# Altium project V1.0.PrjPcb
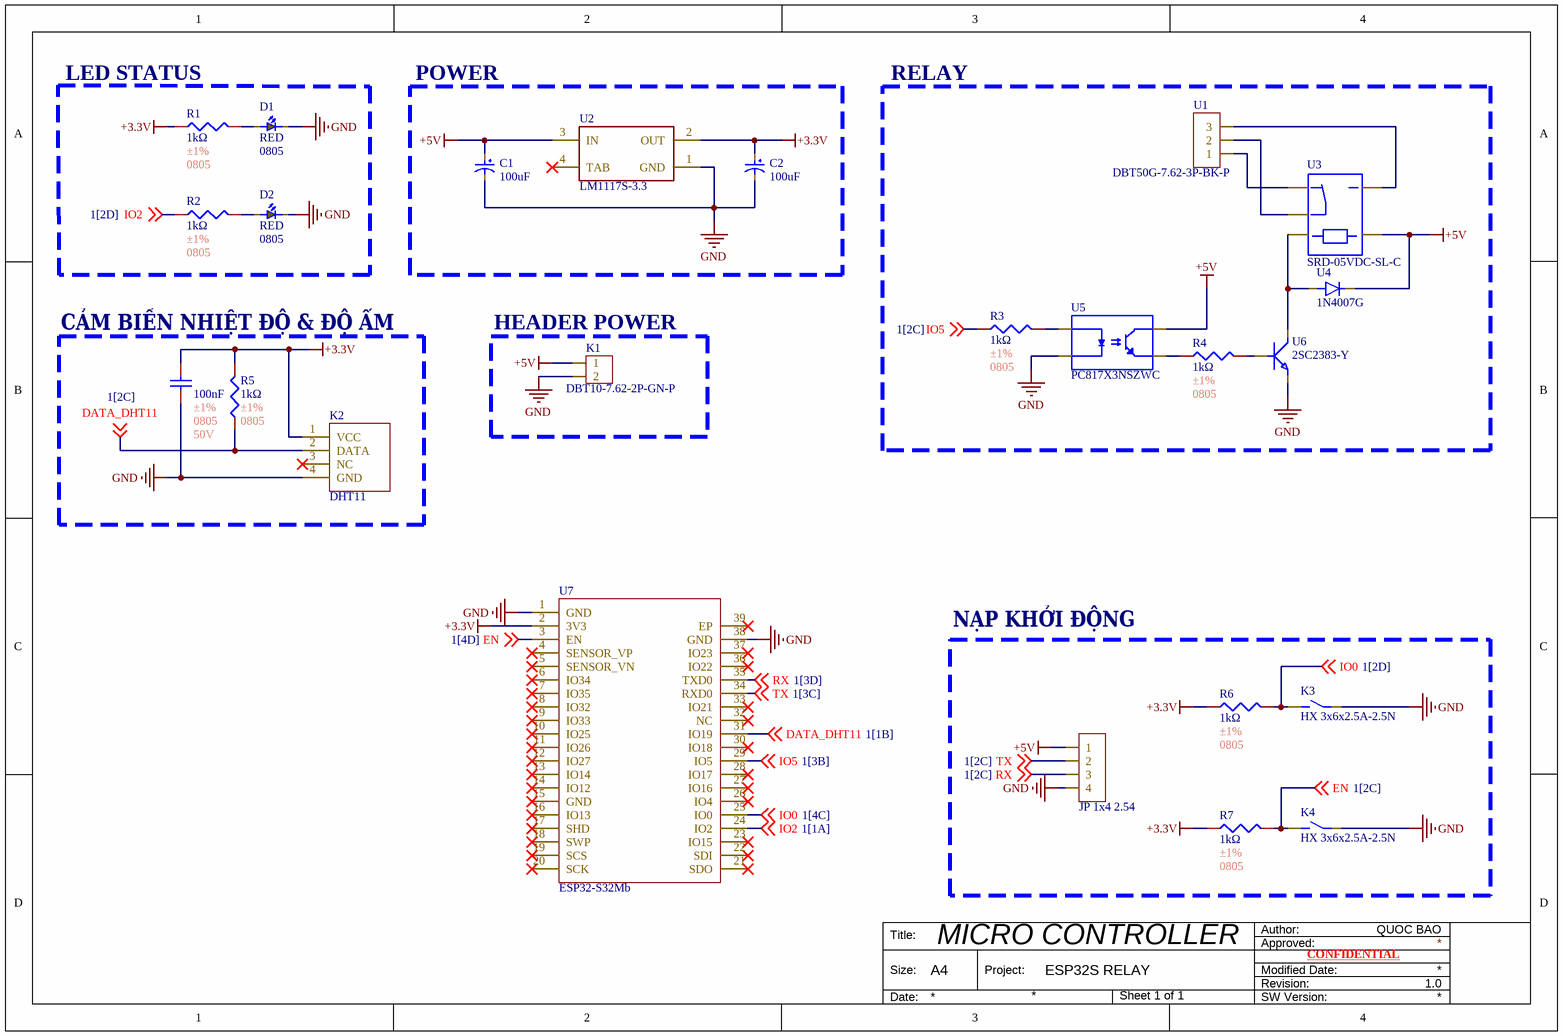
[diagram p0: Micro Controller.SchDoc]
1 sheet, 24 parts. Net scope: global (net labels, ports and power ports of the same name join across sheets).
Board file: PCB1.PcbDoc

## Sheet Micro Controller.SchDoc: MICRO CONTROLLER
size A4; Author: QUOC BAO; Revision: 1.0; SheetNumber: 1; SheetTotal: 1; ProjectTitle: ESP32S RELAY

### Parts
C1  100uF  [C_TH_8x11.5]
C2  100uF  [C_TH_8x11.5]
C3  100nF  Tolerance: ±1%  Package: 0805  Voltage Rating: 50V  [C0805]
D1  RED  Package: 0805  [LED0805]
D2  RED  Package: 0805  [LED0805]
JP1  JP 1x4 2.54  [JP 1X4 DT]
K1  DBT10-7.62-2P-GN-P  [DBT10-7.62-2P-GN-P]
K2  DHT11  [DHT11]
K3  HX 3x6x2.5A-2.5N  [HX 3x6x2.5A-2.5N]
K4  HX 3x6x2.5A-2.5N  [HX 3x6x2.5A-2.5N]
R1  1kΩ  Tolerance: ±1%  Package: 0805  [R0805]
R2  1kΩ  Tolerance: ±1%  Package: 0805  [R0805]
R3  1kΩ  Tolerance: ±1%  Package: 0805  [R0805]
R4  1kΩ  Tolerance: ±1%  Package: 0805  [R0805]
R5  1kΩ  Tolerance: ±1%  Package: 0805  [R0805]
R6  1kΩ  Tolerance: ±1%  Package: 0805  [R0805]
R7  1kΩ  Tolerance: ±1%  Package: 0805  [R0805]
U1  DBT50G-7.62-3P-BK-P  [DBT50G-7.62-3P-BK-P]
U2  LM1117S-3.3  [AMS1117-3.3]
U3  SRD-05VDC-SL-C  [SRD-05VDC-SL-C]
U4  1N4007G  [1N4007G]
U5  PC817X3NSZWC  [PC817X3NSZWC]
U6  2SC2383-Y  [2SC2383-Y]
U7  ESP32-S32Mb  [ESP32-S32Mb]

### Blocks framed on the sheet
LED STATUS: D1 D2 R1 R2
POWER: C1 C2 U2
RELAY: R3 R4 U1 U3-U6
CẢM BIẾN NHIỆT ĐỘ & ĐỘ ẨM: C3 K2 R5
HEADER POWER: K1

### Nets
+3.3V: C2.1 C3.1 K2.1(VCC) R1.1 R5.2 R6.1 R7.1 U2.2(OUT) U7.2(3V3)
+5V: C1.1 JP1.1 K1.1 U2.3(IN) U3.1 U4.1(C) U5.4(COLLECTOR)
GND: C1.2 C2.2 C3.2 D1.2 D2.2 JP1.4 K1.2 K2.4(GND) K3.2 K4.2 U2.1(GND) U5.2(CATHODE) U6.3 U7.1(GND) U7.38(GND)
DATA_DHT11: K2.2(DATA) R5.1 U7.31(IO19) ; off-sheet DATA_DHT11
EN: K4.1 R7.2 U7.3(EN) ; off-sheet EN
IO0: K3.1 R6.2 U7.25(IO0) ; off-sheet IO0
IO2: R2.1 U7.24(IO2) ; off-sheet IO2
IO5: R3.1 U7.29(IO5) ; off-sheet IO5
RX: JP1.3 U7.35(TXD0) ; off-sheet RX
TX: JP1.2 U7.34(RXD0) ; off-sheet TX
NetD1_1: D1.1 R1.2
NetD2_1: D2.1 R2.2
NetR3_2: R3.2 U5.1(ANODE)
NetR4_1: R4.1 U5.3(EMITTER)
NetR4_2: R4.2 U6.1
NetU1_1: U1.1 U3.3
NetU1_2: U1.2 U3.5
NetU1_3: U1.3 U3.2
NetU3_4: U3.4 U4.2(A) U6.2

Not connected (* = marked no-connect by the designer): K2 3(NC)*; U2 4(TAB)*; U7 4(SENSOR_VP)* 5(SENSOR_VN)* 6(IO34)* 7(IO35)* 8(IO32)* 9(IO33)* 10(IO25)* 11(IO26)* 12(IO27)* 13(IO14)* 14(IO12)* 15(GND)* 16(IO13)* 17(SHD)* 18(SWP)* 19(SCS)* 20(SCK)* 21(SDO)* 22(SDI)* 23(IO15)* 26(IO4)* 27(IO16)* 28(IO17)* 30(IO18)* 32(NC)* 33(IO21)* 36(IO22)* 37(IO23)* 39(EP)*

### Notes on the sheet
- NẠP KHỞI ĐỘNG
- Author:
- Title:
- Size:
- A4
- Project:
- Approved:
- Revision:
- Modified Date:
- CONFIDENTIAL
- Date:
- SW Version:

### Library data of the parts
C1 C2 = C_100uF_8x11.5_TH: 3.5mm 100uF 50V ±20% Through Hole,D8xL11.5mm Aluminum Electrolytic Capacitors RoHS; Manufacturer: Rubycon; Mfr. Part #: 50YXF100MEFC8X11.5; Key Attributes: CAP ALUM 100uF ±20% 50V TH; Pin Spacing: 2mm; LCSC Part #: C88728; Package: Through Hole,D5xL11mm; Tolerance: ±20%; Voltage Rating: 50V; Capacitance: 100uF; Link: https://www.lcsc.com/product-detail/C88728.html?s_z=n_capital%2520100u%2520hole
C3 = C0805_100nF_±1%: 50V 10pF NP0 ±1% 0402 Multilayer Ceramic Capacitors MLCC - SMD/SMT ROHS; Manufacturer: YAGEO; Mfr. Part #: CC0402FRNPO9BN100; LCSC Part #: C513681; Link: https://www.lcsc.com/product-detail/C513681.html?s_z=n_capital%2520yageo%252010pF%25200402; Capacitance: 100nF
D1 D2 = D0805_RED: 25mcd~40mcd Water Clear -40℃~+85℃ 624nm Red 120° 60mW 0402 LED Indication - Discrete ROHS; Manufacturer: XINGLIGHT; Mfr. Part #: XL-1005UGC; Voltage - Forward(Vf): 3V; LCSC Part #: C965793; Power(Watts): 60mW; Link: https://www.lcsc.com/product-detail/C136765.html?s_z=n_LED%25200402%2520RED; Illumination Color: RED
JP1 = JP 1x4 2.54 Cai Thang: Cắm; Ten_Linh_Kien: Jump Đơn Cái 2.54MM 1x20P Thẳng; Don_Vi: Con; Ma_Hang: MH004006; Ghi_Chu: *; Kieu_Chan: *; Chung_Loai: Cắm
K1 = DBT10-7.62-2P-GN-P: 1x2P Side Mount 2-Side 7.62mm 1 2 24A -40℃~+105℃ Green 14~22 Straight Pin Through Hole,P=7.62mm Barrier Blocks RoHS; Manufacturer: DORABO; Key Attributes: TERM BLK BARRIER 2CIRCUIT 7.62mm; Mfr. Part #: DBT10-7.62-2P-GN-P; LCSC Part #: C395930; Package: Through Hole,P=7.62mm; Link: https://www.lcsc.com/product-detail/C395930.html?s_z=n_BARRIER%2520STRIP
K2 = DHT11: ±5%RH -20℃~+60℃ 5%RH~95%RH SIP-4 Humidity, Moisture Sensors RoHS; Manufacturer: Aosong; Mfr. Part #: DHT11; LCSC Part #: C117051; Package: SIP-4; Link: https://www.lcsc.com/product-detail/C117051.html?s_z=n_dht11
K3 K4 = HX 3x6x2.5A-2.5N: Without Bracket 6mm 12V 3.6mm Square Button No SPST 50mA SMD,6x3mm Tactile Switches RoHS; Manufacturer: hanxia; Key Attributes: SWITCH TACTILE SPST 250gf SMD; Mfr. Part #: HX 3x6x2.5A-2.5N; LCSC Part #: C36498960; Package: SMD,6x3mm; Link: https://www.lcsc.com/product-detail/C36498960.html?s_z=n_button
R1-R7 = R0805_1kΩ_±1%: 62.5mW Thick Film Resistor 50V ±1% ±200ppm/℃ 10Ω 0402 Chip Resistor - Surface Mount ROHS; Manufacturer: YAGEO; Mfr. Part #: RC0805FR-0710RL; LCSC Part #: C138066; Resistance: 1kΩ; Link: https://www.lcsc.com/product-detail/C138066.html?s_z=n_resistor%25200402%252010R
U1 = DBT50G-7.62-3P-BK-P: 1x3P Side Mount With Cover Plate 7.62mm 1 3 -40℃~+105℃ 20A Black 12~22 Straight Pin Through Hole,P=7.62mm Barrier Blocks RoHS; Manufacturer: DORABO; Key Attributes: TERM BLK BARRIER 3CIRCUIT 7.62mm; Mfr. Part #: DBT50G-7.62-3P-BK-P; LCSC Part #: C496128; Package: Through Hole,P=7.62mm; Link: https://www.lcsc.com/product-detail/C496128.html?s_z=n_Barrier%2520blocks
U2 = LM1117S-3.3: 75dB@(120Hz) 1A Fixed 3.3V Positive 12V SOT-223-3 Voltage Regulators - Linear, Low Drop Out (LDO) Regulators ROHS; Manufacturer: HTC; Noise: 100uV; Mfr. Part #: LM1117S-3.3; LCSC Part #: C126027; Package: SOT-223-3; Output Current: 1A; Voltage - Supply: 12V; Link: https://www.lcsc.com/product-detail/C126027.html?s_z=n_lm1117-33
U3 = SRD-05VDC-SL-C: 250V@AC 5V 15A Through Hole,19.2x15.6mm Power Relays RoHS; Manufacturer: Songle Relay; Key Attributes: Single group transfer type relay; Mfr. Part #: SRD-05VDC-SL-C; LCSC Part #: C35449; Package: Through Hole,19.2x15.6mm; Link: https://www.lcsc.com/product-detail/C35449.html?s_z=n_relay
U4 = 1N4007G: 30A 1kV 930mV@1A 1A DO-41 Single Diodes RoHS; Manufacturer: onsemi; Key Attributes: DIODE STANDARD 1kV 1A DO-41; Mfr. Part #: 1N4007G; LCSC Part #: C232439; Package: DO-41; Link: https://www.lcsc.com/product-detail/C232439.html?s_z=n_1N4007
U5 = PC817X3NSZWC: 50mA 100mV@20mA,1mA 80V 6V DC DIP-4 Transistor, Photovoltaic Output Optoisolators RoHS; Manufacturer: SHARP; Key Attributes: OPTOISOLATOR 5kV 1CH TRANS DIP-4; Mfr. Part #: PC817X3NSZWC; LCSC Part #: C39832427; Package: DIP-4; Link: https://www.lcsc.com/product-detail/C39832427.html?s_z=n_pc817
U6 = 2SC2383-Y: 900mW 160V 1A NPN TO-92LM Single Bipolar Transistors RoHS; Manufacturer: BLUE ROCKET; Key Attributes: TRANS NPN 160V 1A TO-92LM; Mfr. Part #: 2SC2383-Y; LCSC Part #: C2844058; Package: TO-92LM; Link: https://www.lcsc.com/product-detail/C2844058.html?s_z=n_c2383
U7 = ESP32-S32Mb: 2.4GHz ESP32 Chip On-board PCB Antenna -90dBm RF Transceiver Modules and Modems RoHS; Manufacturer: Ai-Thinker; Key Attributes: ESP32-S Wi-Fi + BT SoC Module; Mfr. Part #: ESP32-S32Mb; LCSC Part #: C2764096; Package: SMD; Link: https://www.lcsc.com/product-detail/C2764096.html?s_z=n_esp32